# EAGLE design RumiCarGen3-CM5 (EAGLE 9.6.1)
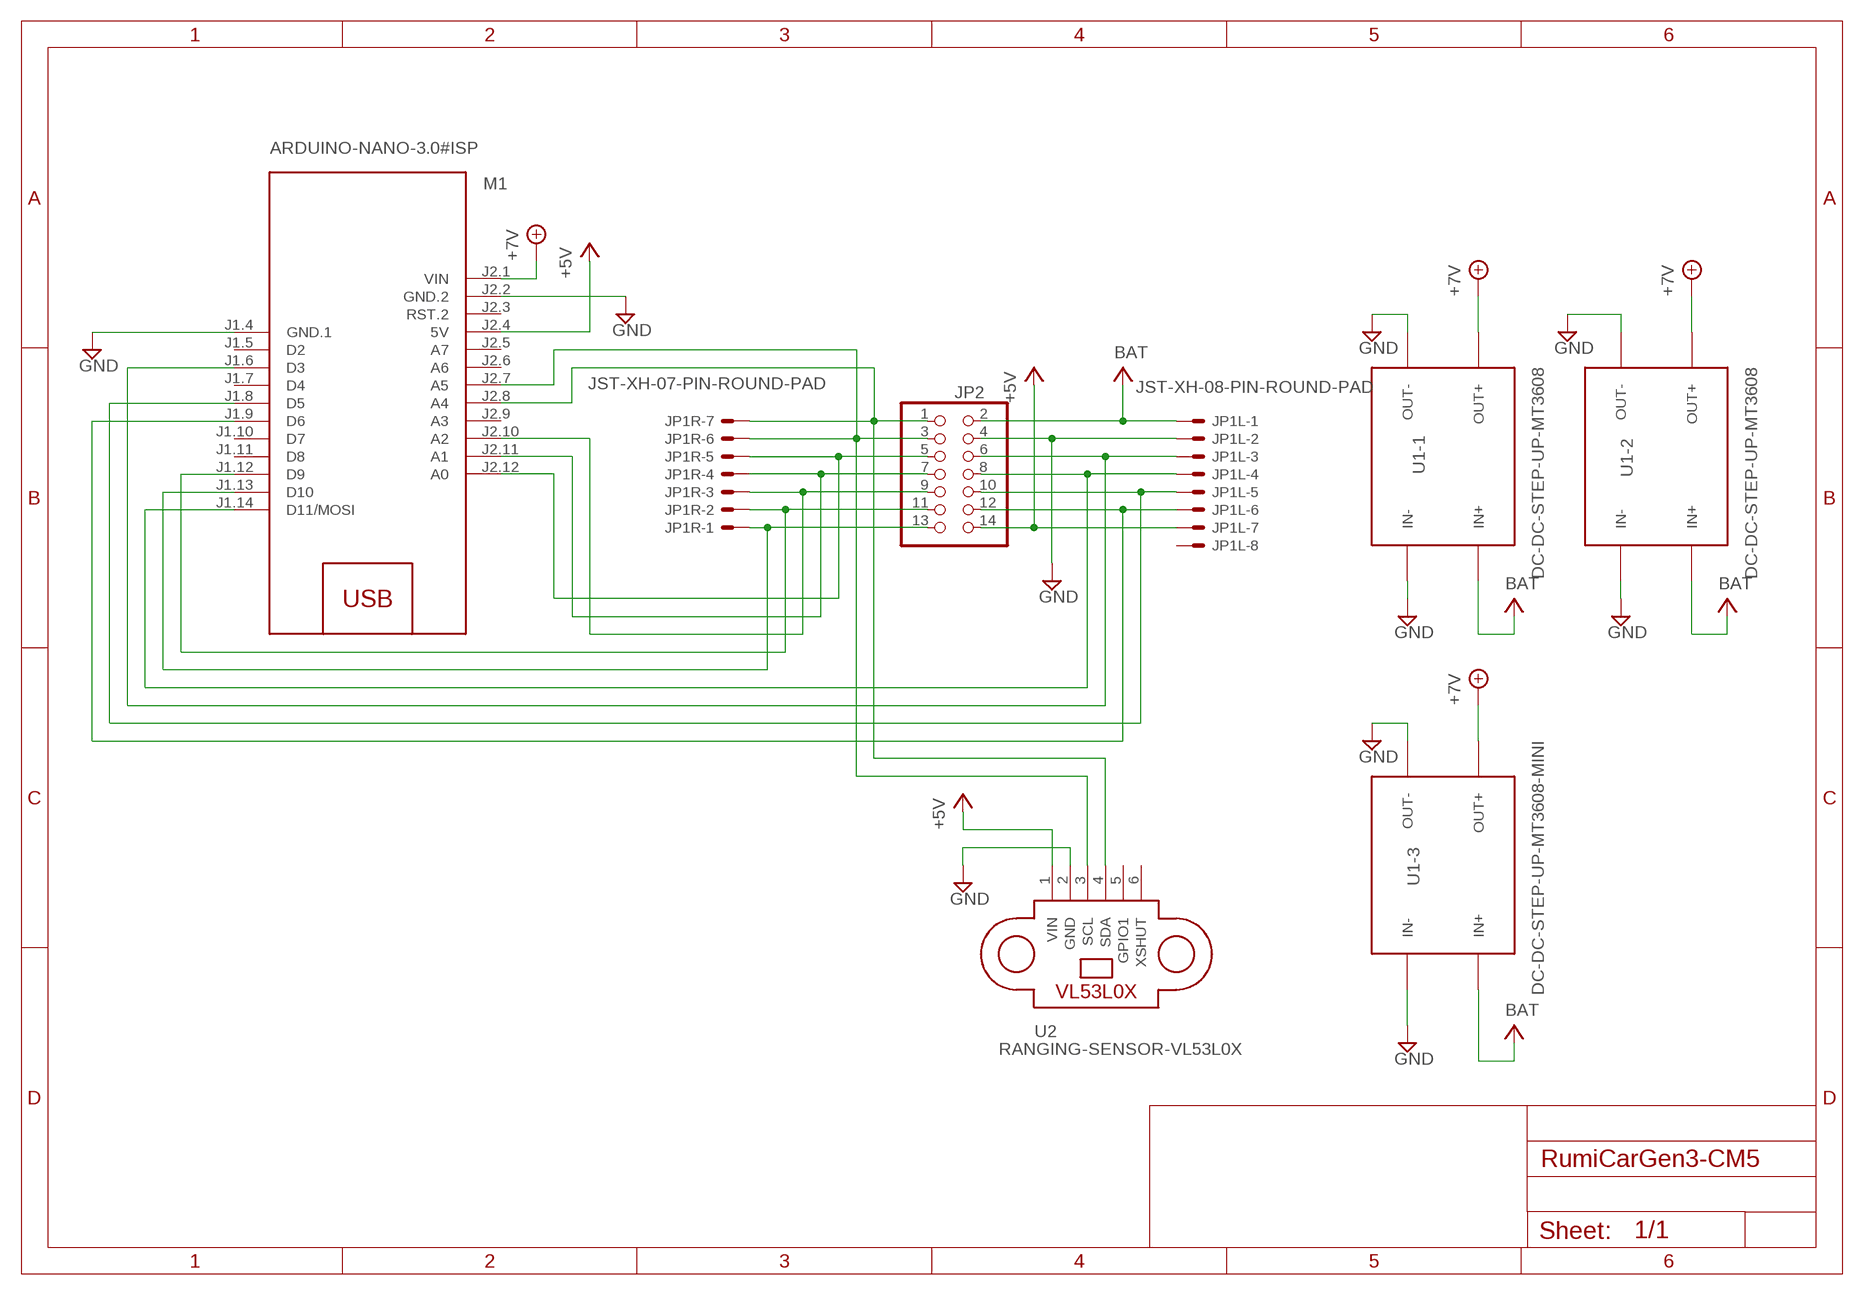
[diagram p0: schematic, sheet 1]

## Parts
JP1L  JST-XH-08-PIN-ROUND-PAD  [JST-XH-08-PACKAGE-ROUND-PAD]
JP1R  JST-XH-07-PIN-ROUND-PAD  [JST-XH-07-PACKAGE-ROUND-PAD]
JP2  PINHD-2X7  [2X07]
M1  ARDUINO-NANO-3.0#ISP  [ARDUINO-NANO-3.0#ISP]
U1-1  DC-DC-STEP-UP-MT3608  [DC-DC-STEP-UP-MT3608]
U1-2  DC-DC-STEP-UP-MT3608  [DC-DC-STEP-UP-MT3608]
U1-3  DC-DC-STEP-UP-MT3608-MINI  [DC-DC-STEP-UP-MT3608-MINI]
U2  RANGING-SENSOR-VL53L0X  [RANGING-SENSOR-VL53L0X]

## Nets
+5V: JP1L.7 JP2.14 M1.J2.4(5V) U2.1(VIN)
+7V: M1.J2.1(VIN) U1-1.OUT+ U1-2.OUT+ U1-3.OUT+
GND: JP1L.2 JP2.4 M1.J1.4(GND.1) M1.J2.2(GND.2) U1-1.IN- U1-1.OUT- U1-2.IN- U1-2.OUT- U1-3.IN- U1-3.OUT- U2.2(GND)
N$1: JP1L.6 JP2.12 M1.J1.9(D6)
N$2: JP1L.5 JP2.10 M1.J1.8(D5)
N$30: JP1L.3 JP2.6 M1.J1.6(D3)
N$33: JP1L.4 JP2.8 M1.J1.14(D11/MOSI)
N$34: JP1R.1 JP2.13 M1.J1.13(D10)
N$37: JP1R.2 JP2.11 M1.J1.12(D9)
N$38: JP1R.3 JP2.9 M1.J2.10(A2)
N$39: JP1R.4 JP2.7 M1.J2.11(A1)
N$40: JP1R.5 JP2.5 M1.J2.12(A0)
N$41: JP1R.7 JP2.1 M1.J2.8(A4) U2.4(SDA)
N$42: JP1R.6 JP2.3 M1.J2.7(A5) U2.3(SCL)
V+: JP1L.1 JP2.2 U1-1.IN+ U1-2.IN+ U1-3.IN+ ; supply symbol labelled BAT
Unconnected: JP1L.8 M1.J1.5(D2) M1.J1.7(D4) M1.J1.10(D7) M1.J1.11(D8) M1.J2.3(RST.2) M1.J2.5(A7) M1.J2.6(A6) M1.J2.9(A3) U2.5(GPIO1) U2.6(XSHUT)

## Library data of the parts
JP1L = Rembrandt Electronics - JST XH Connectors v1-0:JST-XH-08-PIN: JST XH Connector 2 Pin Wire to board connector. Pitch: 2,54 mm, (0.100") Number of pins: 8 Created by Rembrandt Electronics www.rembrandtelectronics.com
JP1R = Rembrandt Electronics - JST XH Connectors v1-0:JST-XH-07-PIN: JST XH Connector 2 Pin Wire to board connector. Pitch: 2,54 mm, (0.100") Number of pins: 7 Created by Rembrandt Electronics www.rembrandtelectronics.com
JP2 = pinhead:PINHD-2X7: PIN HEADER
M1 = diy-modules:ARDUINO-NANO-3.0#ISP: Arduino Nano 3.0 (and compatible devices) with ISP pads More details available here: https://www.arduino.cc/en/Main/ArduinoBoardNano Click here to find device on ebay.com <http://www.ebay.com/sch/arduino+nano>
U1-1 = diy-modules:DC-DC-STEP-UP-MT3608: DC/DC Step-Up Regulator based on MT3608 chip MT3608 datasheet available here: https://www.olimex.com/Products/Breadboarding/BB-PWR-3608/resources/MT3608.pdf Click here to find device on ebay.com <http://www.ebay.com/sch/mt3608+module>
U1-2 = dc-dc-boost-2a-microusb-mt3608:DC-DC-STEP-UP-MT3608: DC/DC Step-Up Regulator based on MT3608 chip MT3608 datasheet available here: https://www.olimex.com/Products/Breadboarding/BB-PWR-3608/resources/MT3608.pdf Click here to find device on ebay.com <http://www.ebay.com/sch/mt3608+module>
U1-3 = dc-dc-boost-2a-microusb-mt3608-mini:DC-DC-STEP-UP-MT3608-MINI
U2 = diy-modules:RANGING-SENSOR-VL53L0X: Laser Ranging Sensor based on VL53L0X device More information about VL53L0X device can be found here: http://www.st.com/en/imaging-and-photonics-solutions/vl53l0x.html Arduino Library for VL53L0X is available here: https://github.com/pololu/vl53l0x-arduino Click here to find device on ebay.com <http://www.ebay.com/sch/GY+VL53L0X+module> Note: There are many variants. Search for the proper version.

## Board
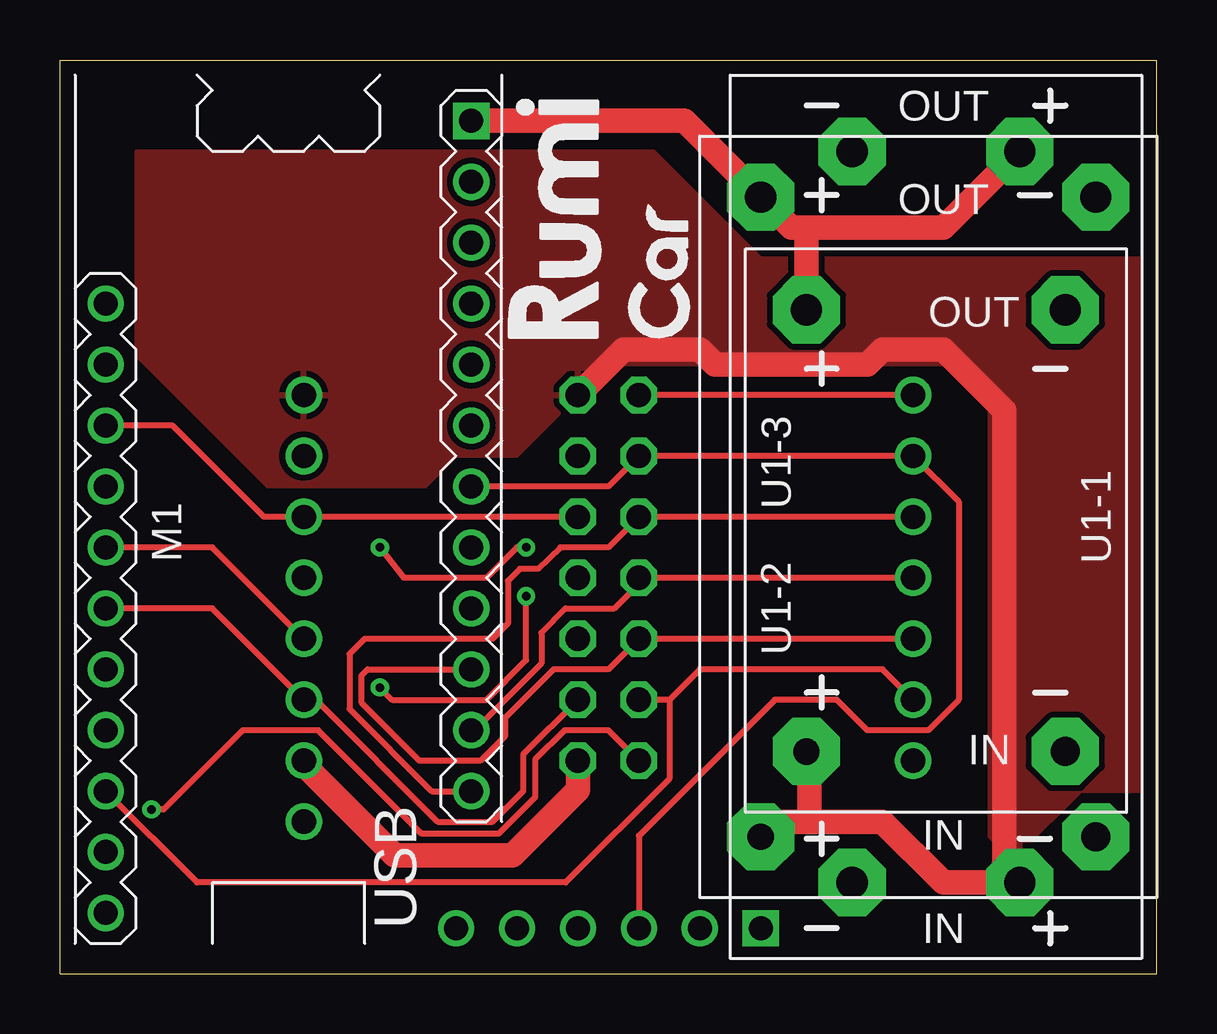
[diagram p1: board, top side]
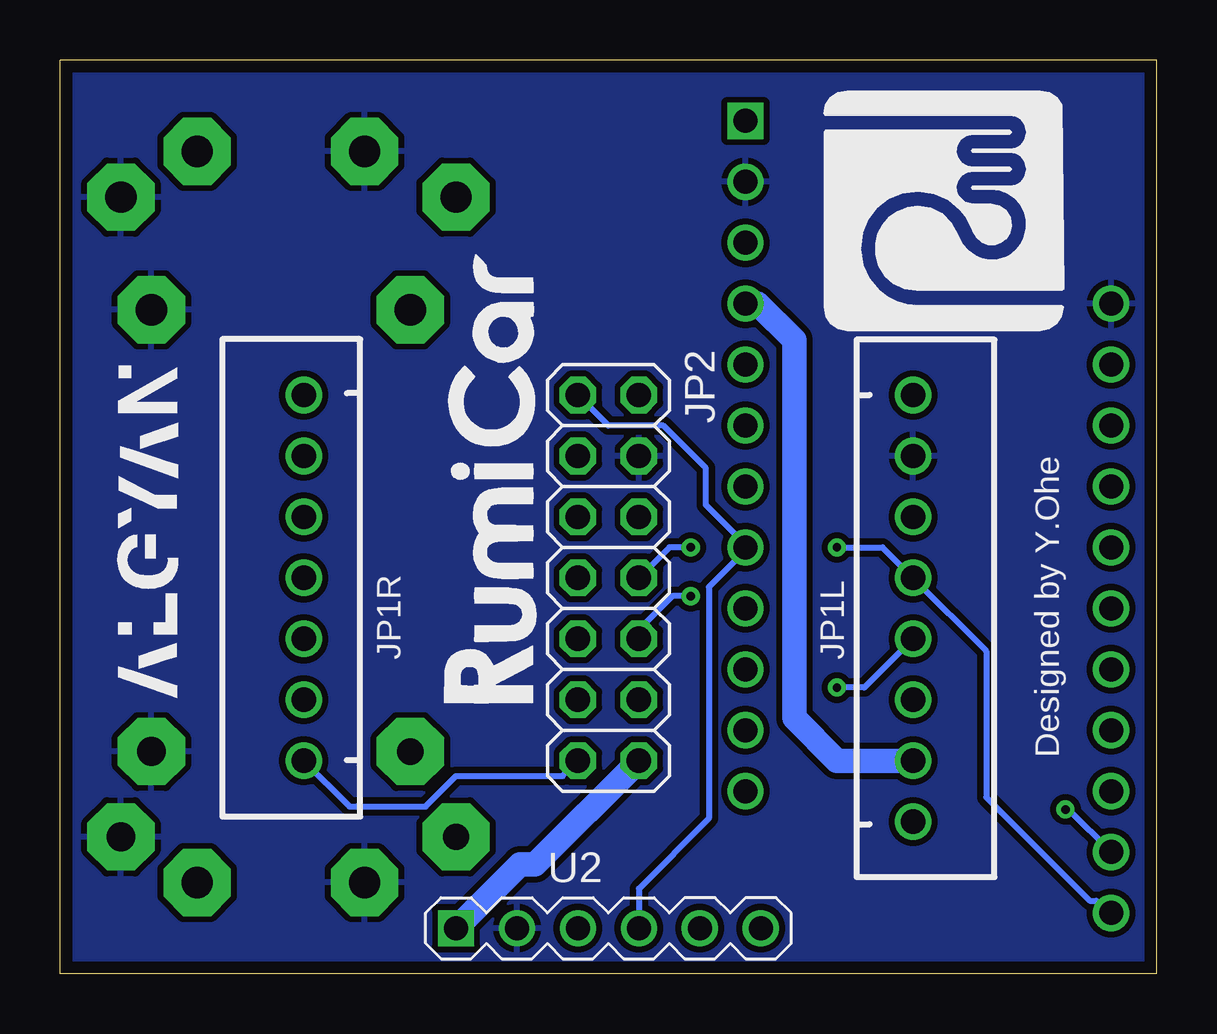
[diagram p2: board, bottom side, seen from below]

Size 45.72 x 38.1 mm. Coordinates in mm from the lower left corner, seen from the top.
Outline: 0,38.1 45.72,38.1 45.72,0 0,0 0,38.1
Copper layers (1*16): Top 0.035mm / dielectric 1.5mm / Bottom 0.035mm
Design rules "default *": minimum track width 10mil, minimum drill 0.35mm, track to track 10mil, track to pad 10mil, pad to pad 10mil, via to via 10mil, smd to smd 10mil, copper to edge 20mil, drill to drill 6mil, minimum pad ring 10mil, minimum via ring 8mil, stop-mask expansion 4mil, vias tented up to drill 0mil, thermal gap 10mil

### Footprints (pad centres in the part's own frame; a part is rotated, then mirrored left to right if it is on the bottom)
JST-XH-08-PACKAGE-ROUND-PAD = drill 1.016: 1 -8.89,0; 2 -6.35,0; 3 -3.81,0; 4 -1.27,0; 5 1.27,0; 6 3.81,0; 7 6.35,0; 8 8.89,0
JST-XH-07-PACKAGE-ROUND-PAD = drill 1.016: 1 -7.62,0; 2 -5.08,0; 3 -2.54,0; 4 0,0; 5 2.54,0; 6 5.08,0; 7 7.62,0
2X07 = drill 1.016 octagon: 1 -7.62,-1.27; 2 -7.62,1.27; 3 -5.08,-1.27; 4 -5.08,1.27; 5 -2.54,-1.27; 6 -2.54,1.27; 7 0,-1.27; 8 0,1.27; 9 2.54,-1.27; 10 2.54,1.27; 11 5.08,-1.27; 12 5.08,1.27; 13 7.62,-1.27; 14 7.62,1.27
ARDUINO-NANO-3.0#ISP = drill 1: J1.4 10.16,7.62; J1.5 7.62,7.62; J1.6 5.08,7.62; J1.7 2.54,7.62; J1.8 0,7.62; J1.9 -2.54,7.62; J1.10 -5.08,7.62; J1.11 -7.62,7.62; J1.12 -10.16,7.62; J1.13 -12.7,7.62; J1.14 -15.24,7.62; J2.2 15.24,-7.62; J2.3 12.7,-7.62; J2.4 10.16,-7.62; J2.5 7.62,-7.62; J2.6 5.08,-7.62; J2.7 2.54,-7.62; J2.8 0,-7.62; J2.9 -2.54,-7.62; J2.10 -5.08,-7.62; J2.11 -7.62,-7.62; J2.12 -10.16,-7.62 | drill 1 square: J2.1 17.78,-7.62
DC-DC-STEP-UP-MT3608 = drill 1.3 pad 2.8 octagon: IN+ 15.24,3.175; IN- 15.24,-3.81; OUT+ -15.24,3.175; OUT- -15.24,-3.81
DC-DC-STEP-UP-MT3608' = drill 1.1 pad 2.8 octagon: IN+ -12.7,7.62 | drill 1.2 pad 2.8 octagon: IN- -12.7,-6.35 | drill 1.3 pad 2.8 octagon: OUT+ 13.97,7.62; OUT- 13.97,-6.35
DC-DC-STEP-UP-MT3608-MINI = drill 1.1 pad 2.8 octagon: IN+ -12.7,4.445 | drill 1.2 pad 2.8 octagon: IN- -12.7,-6.35 | drill 1.3 pad 2.8 octagon: OUT+ 5.715,4.445; OUT- 5.715,-6.35
RANGING-SENSOR-VL53L0X = drill 1 square: 1 -3.81,6.35 | drill 1: 2 -3.81,3.81; 3 -3.81,1.27; 4 -3.81,-1.27; 5 -3.81,-3.81; 6 -3.81,-6.35

### Placement (x,y rotation side)
JP1L  10.16,15.24 270 bottom
JP1R  35.56,16.51 90 bottom
JP2  22.86,16.51 270 bottom
M1  9.53,17.78 90 top
U1-1  36.83,19.05 270 top
U1-2  DC-DC-STEP-UP-MT3608  [DC-DC-STEP-UP-MT3608']  36.83,18.41 90 top
U1-3  35.56,21.97 90 top
U2  22.86,5.71 90 bottom

### Tracks (layer width: path | path; a pad name or v marks a point on that pad's centre or on a via)
+5V
  Top 1.016: JP1L.7 10.16,8.74 13.95,4.95 18.87,4.95 21.59,7.68 JP2.14
  Bottom 1.016: M1.J2.4 16.64,27.94 15.11,26.42 15.11,10.67 13.34,8.89 JP1L.7 | JP2.14 25.91,4.57 26.54,4.57 U2.1
+7V
  Top 1.016: M1.J2.1 26.04,35.56 U1-2.OUT+ 30.48,31.11 31.11,31.11 | U1-1.OUT+ 36.83,31.11 31.11,31.11 | U1-3.OUT+ 31.11,31.11
GND
  pour Bottom: 0.51,37.59 0.51,0.51 45.21,0.51 45.21,37.59
N$1
  Top 0.254: JP2.12 19.3,9.14 19.3,7.62 18.03,6.35 15.75,6.35 10.67,11.43 JP1L.6 6.35,15.24 M1.J1.9
N$2  (via drill 0.35)
  Top 0.254: v19.43,15.75 19.43,13.08 17.78,11.43 13.84,11.43 v13.34,11.94 | JP1L.5 6.35,17.78 M1.J1.8
  Bottom 0.254: v19.43,15.75 20.19,15.75 21.59,14.35 JP2.10 | v13.34,11.94 12.19,11.94 JP1L.5
N$30
  Top 0.254: M1.J1.6 4.7,22.86 8.51,19.05 JP1L.3 JP2.6
N$33  (via drill 0.35)
  Top 0.254: v19.43,17.78 19.05,17.78 17.78,16.51 14.35,16.51 v13.34,17.78
  Bottom 0.254: JP2.8 20.32,17.78 v19.43,17.78 | M1.J1.14 2.03,2.54 2.54,3.05 2.79,3.05 7.11,7.37 7.11,13.46 JP1L.4 11.43,17.78 v13.34,17.78
N$34  (via drill 0.35)
  Top 0.254: JP2.13 22.86,10.16 21.04,10.16 19.81,8.93 19.81,7.37 18.29,5.84 15.08,5.84 10.76,10.16 7.62,10.16 4.32,6.86 v3.81,6.86
  Bottom 0.254: JP1R.1 33.66,6.99 30.48,6.99 29.21,8.26 24.77,8.26 JP2.13 | M1.J1.13 3.69,6.86 v3.81,6.86
N$37
  Top 0.254: JP1R.2 34.29,12.7 26.67,12.7 25.4,11.43 | 25.4,11.43 JP2.11 | 25.4,11.43 25.4,8.13 21.08,3.81 5.71,3.81 M1.J1.12
N$38
  Top 0.254: M1.J2.10 12.83,12.7 12.57,12.45 12.57,11.3 14.99,8.89 17.53,8.89 18.54,9.91 18.54,10.67 20.57,12.7 22.86,12.7 JP2.9 JP1R.3
N$39
  Top 0.254: M1.J2.11 17.27,10.16 20.07,12.95 20.07,14.22 21.08,15.24 23.11,15.24 24.13,16.26 JP2.7 JP1R.4
N$40
  Top 0.254: M1.J2.12 15.49,7.62 12.06,11.05 12.06,13.34 12.7,13.97 18.03,13.97 18.67,14.61 18.67,16.38 19.18,16.89 19.93,16.89 20.86,17.78 22.86,17.78 JP2.5 JP1R.5
N$41
  Top 0.254: JP1R.7 JP2.1
  Bottom 0.254: JP2.1 22.86,22.86 20.57,22.86 18.8,21.08 18.8,19.56 17.02,17.78 | 17.02,17.78 18.67,16.13 18.67,6.48 21.59,3.56 U2.4 | 17.02,17.78 M1.J2.8
N$42
  Top 0.254: M1.J2.7 22.86,20.32 JP2.3 JP1R.6 37.47,19.68 37.47,11.43 36.2,10.16 33.66,10.16 32.38,11.43 29.8,11.43 24.13,5.76 U2.3
V+
  Top 1.016: U1-2.IN+ 29.84,6.35 31.24,6.35 | 31.24,6.35 34.29,6.35 36.83,3.81 U1-1.IN+ 39.37,4.45 39.37,23.5 36.83,26.04 34.29,26.04 33.66,25.4 27.3,25.4 26.67,26.04 23.5,26.04 JP2.2 | U1-3.IN+ 31.24,9.14 31.24,6.35
  pour Top: 3.17,34.29 3.17,25.78 8.64,20.32 15.24,20.32 16.51,21.59 19.05,21.59 22.86,25.4 37.47,25.4 38.73,24.13 38.73,5.71 39.37,5.08 40.01,5.08 42.55,7.62 45.09,7.62 45.09,29.84 29.21,29.84 24.77,34.29

### Text on the board
bPlace: Designed by Y.Ohe